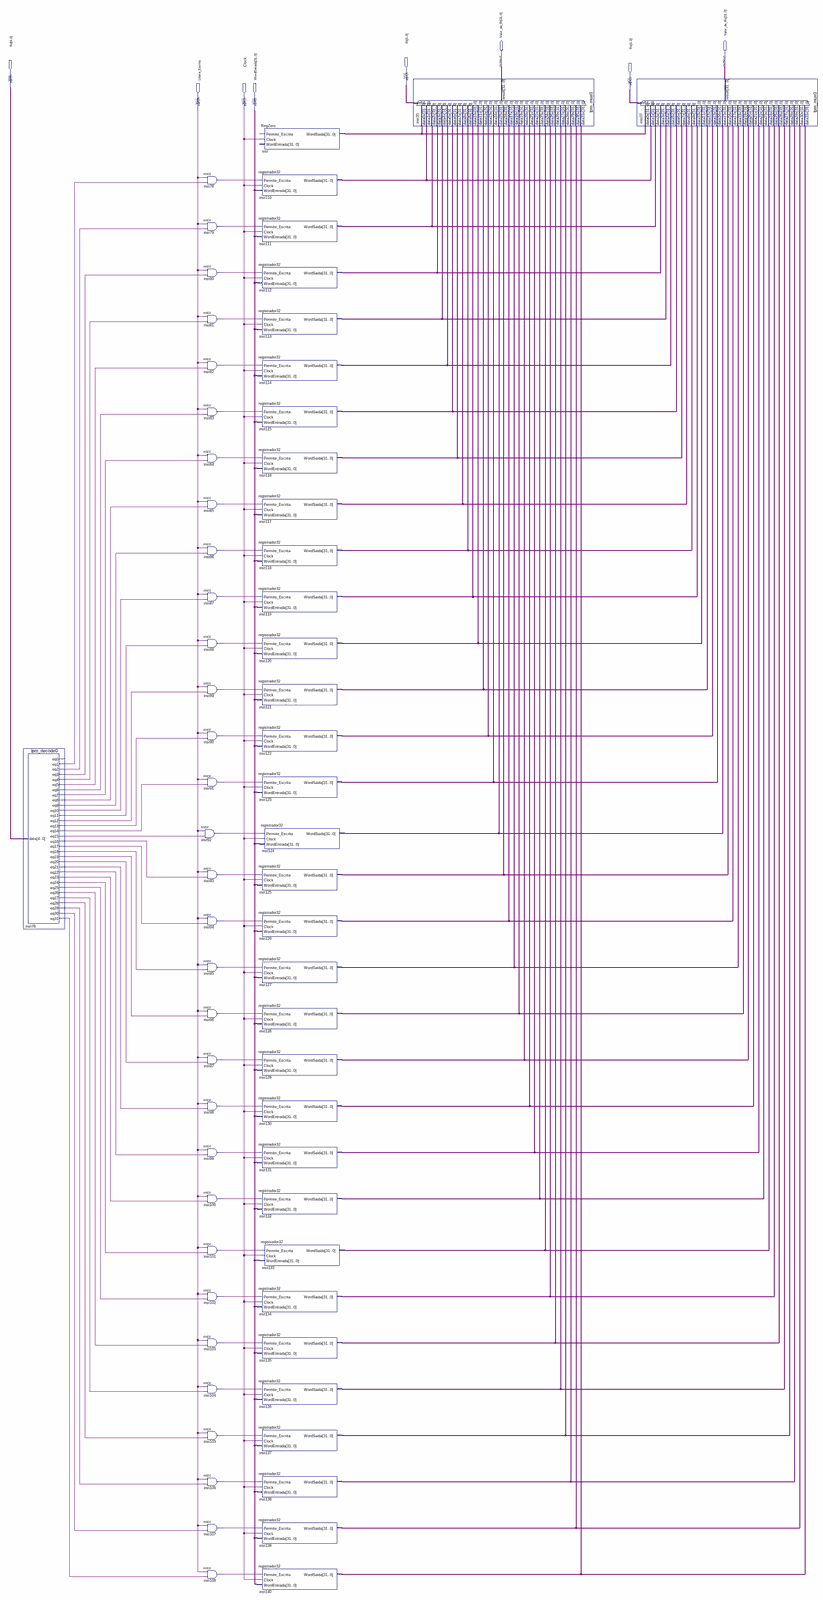
[diagram p0: schematic sheet, whole]
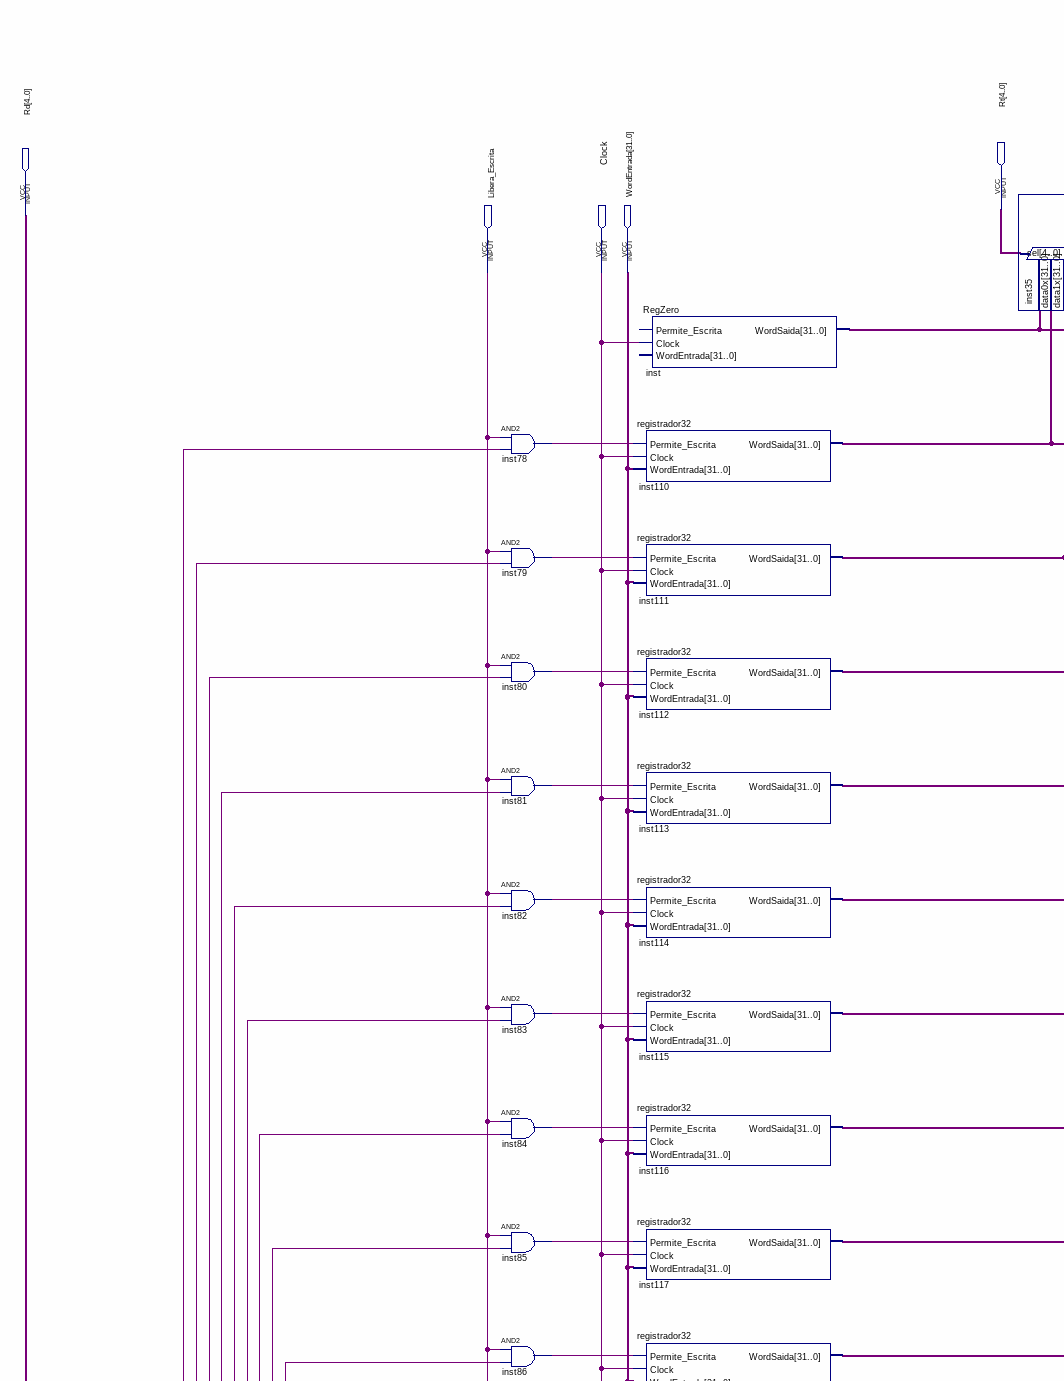
[diagram p1: schematic sheet, upper left part]
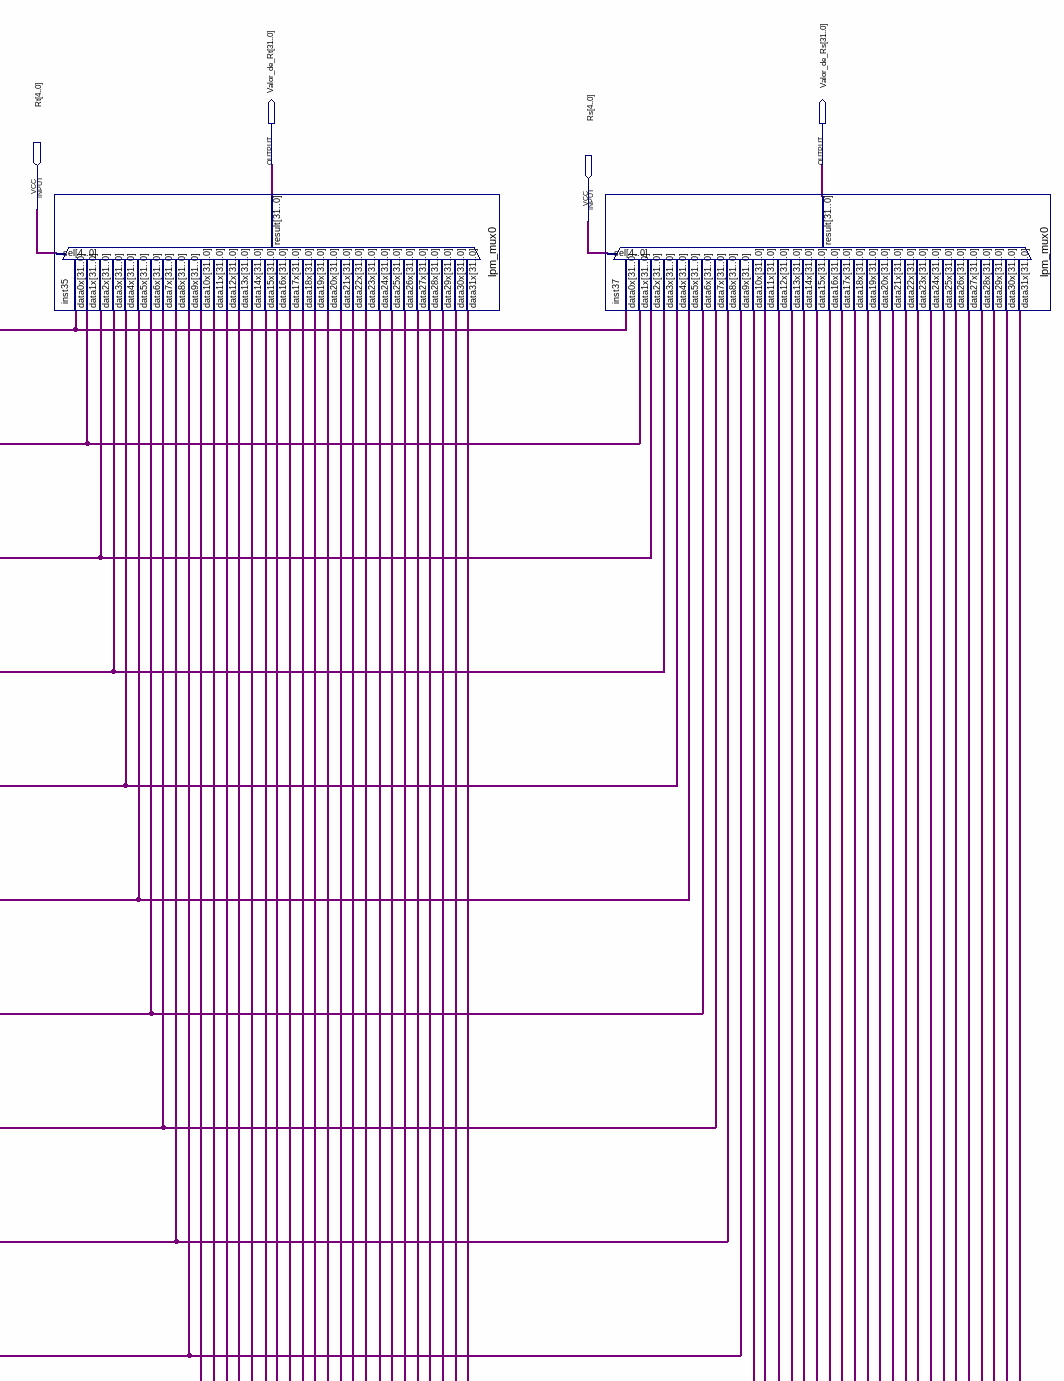
[diagram p2: schematic sheet, upper right part]
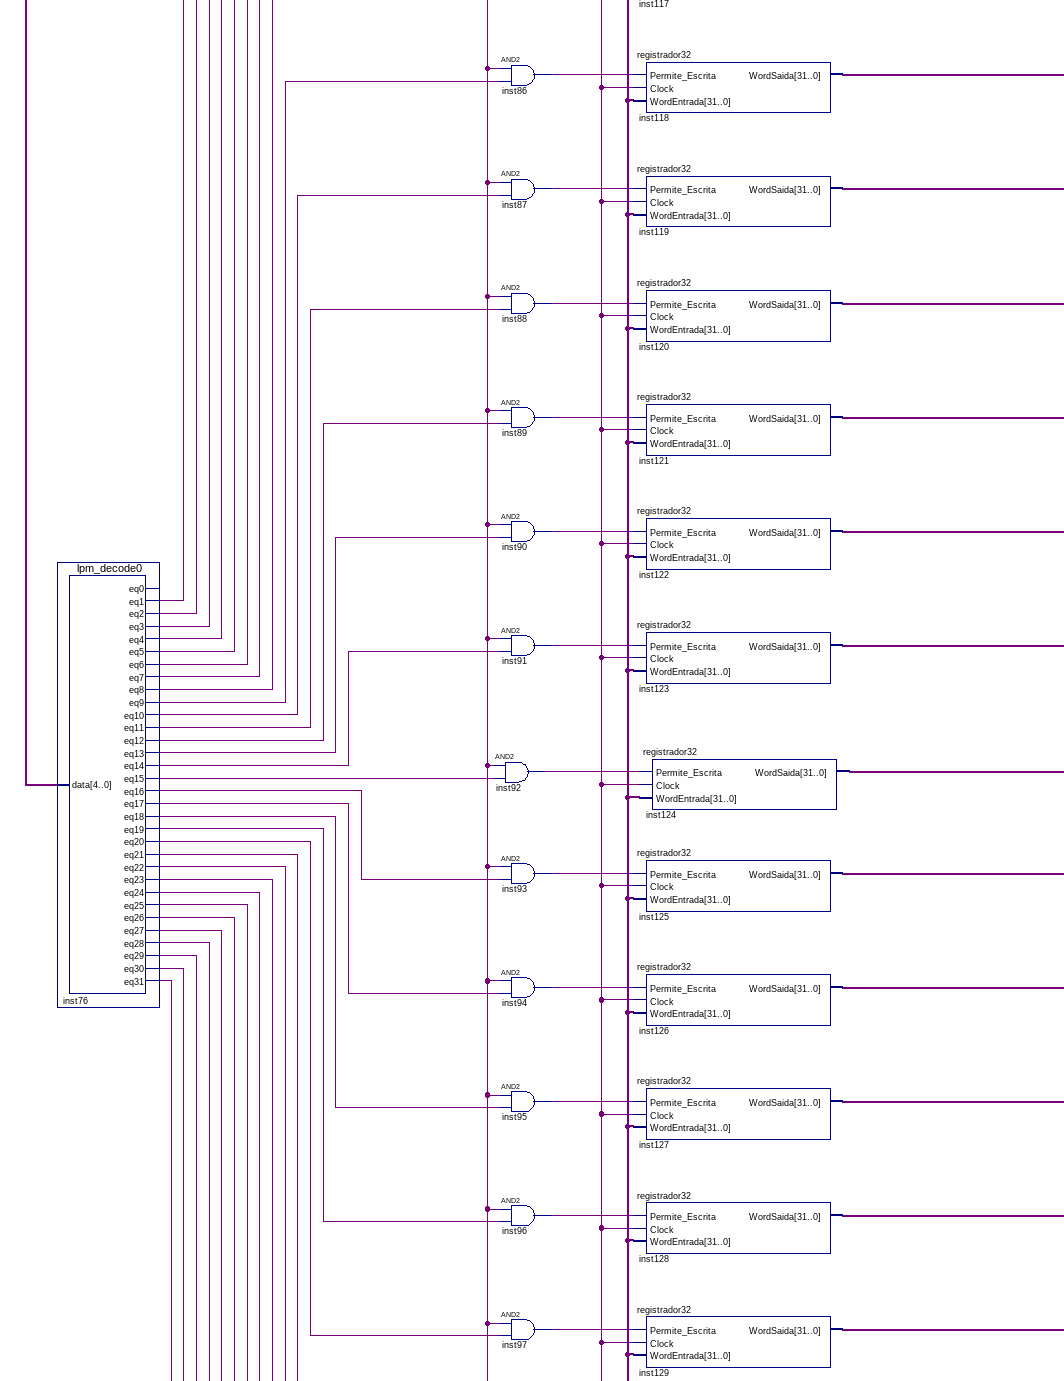
[diagram p3: schematic sheet, middle left part]
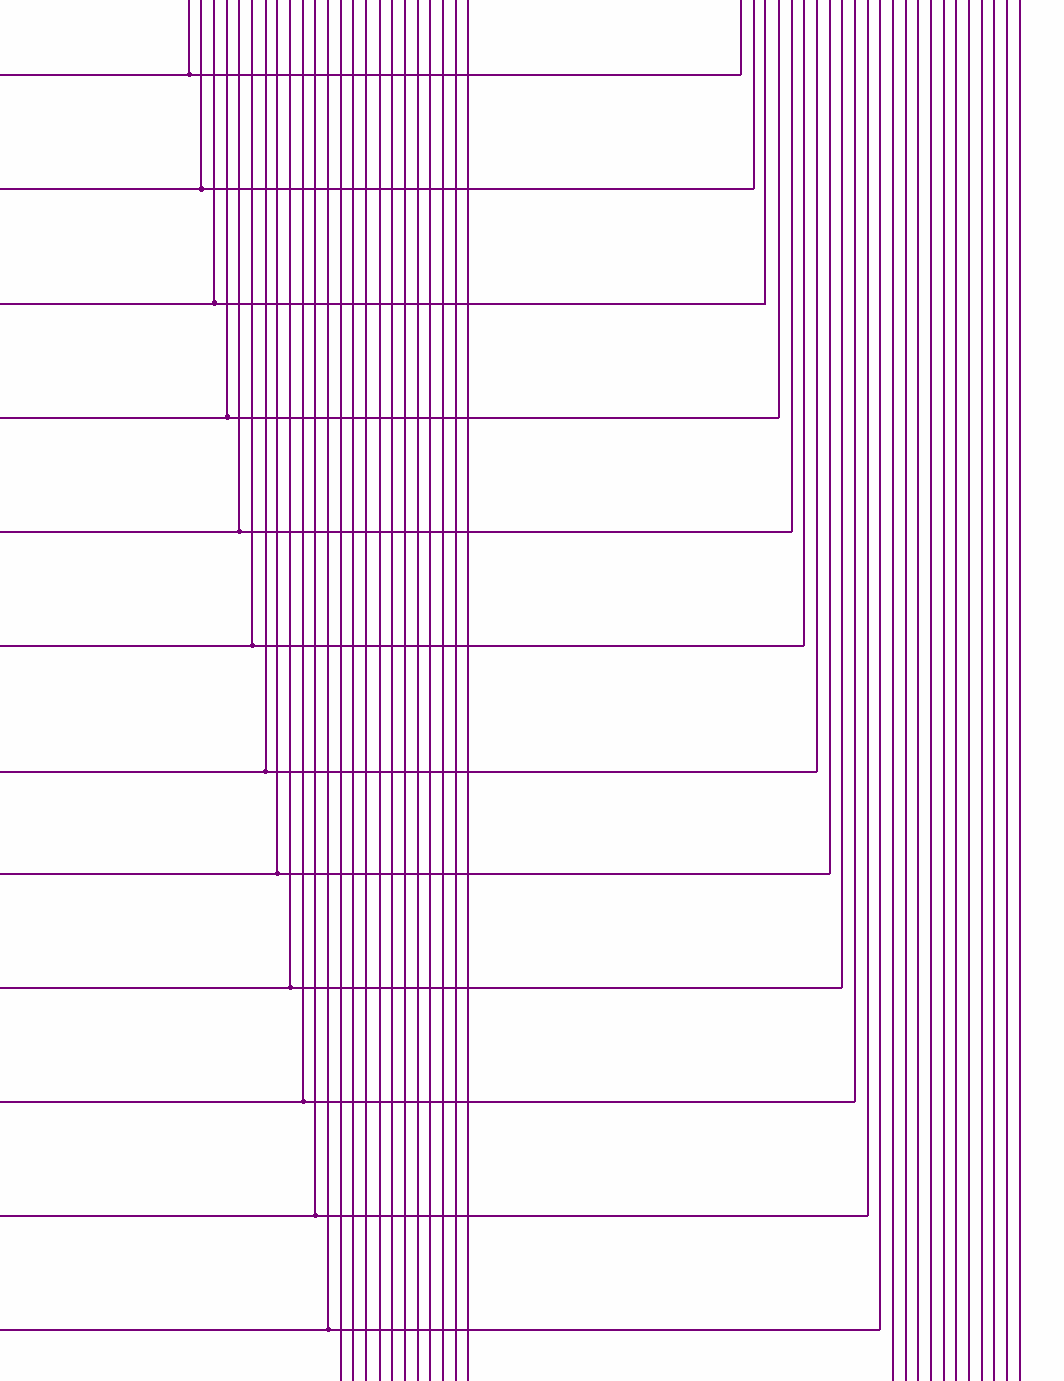
[diagram p4: schematic sheet, middle right part]
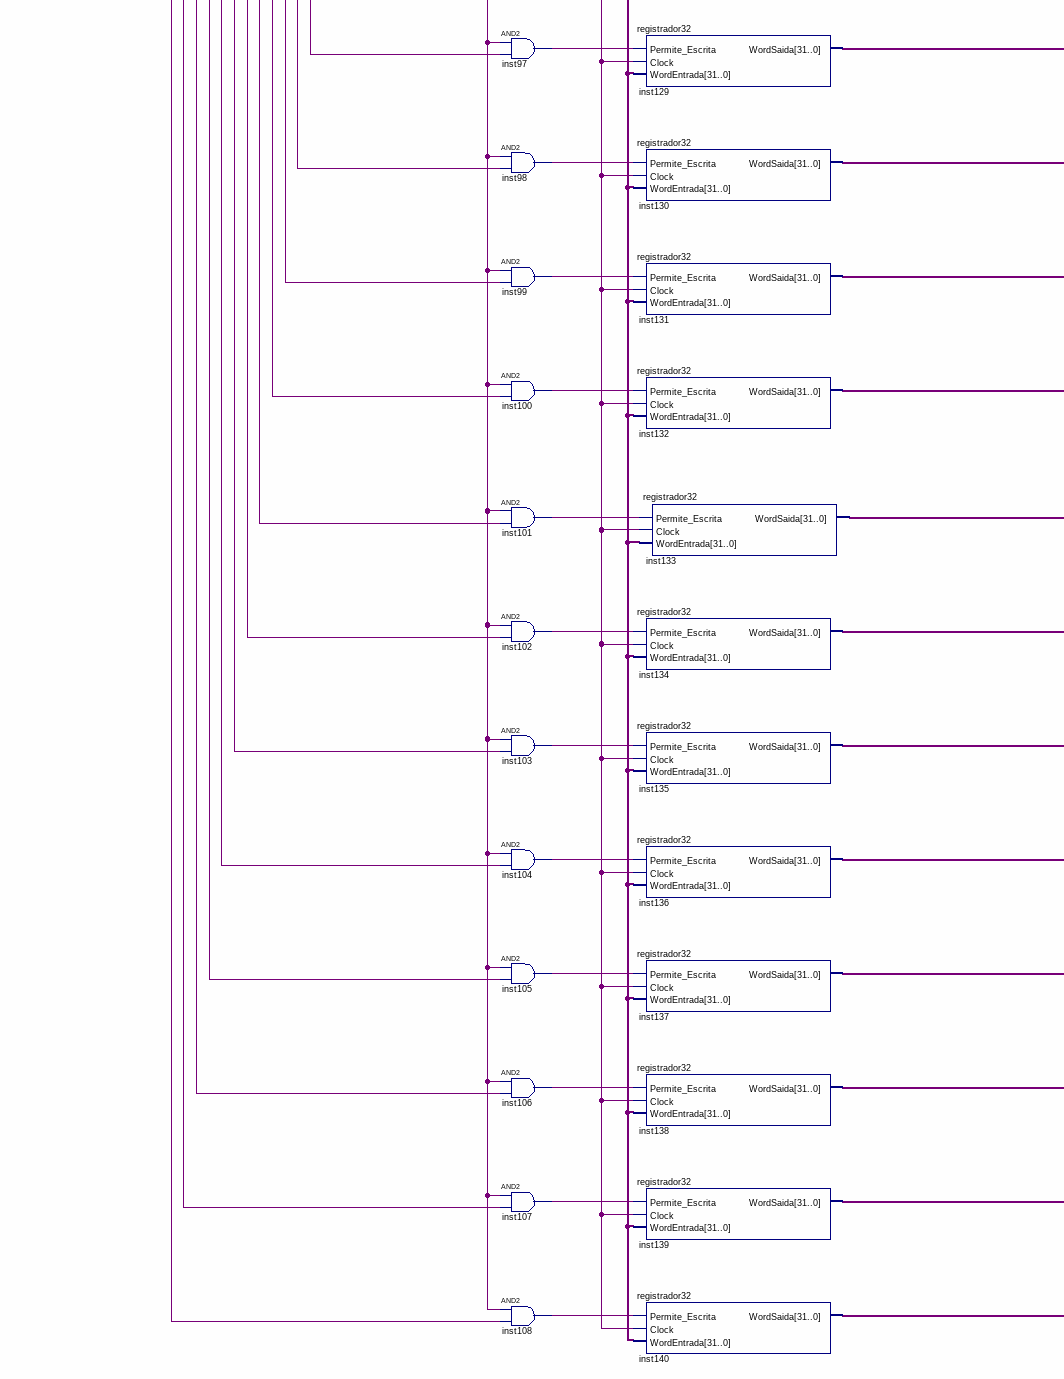
[diagram p5: schematic sheet, lower left part]
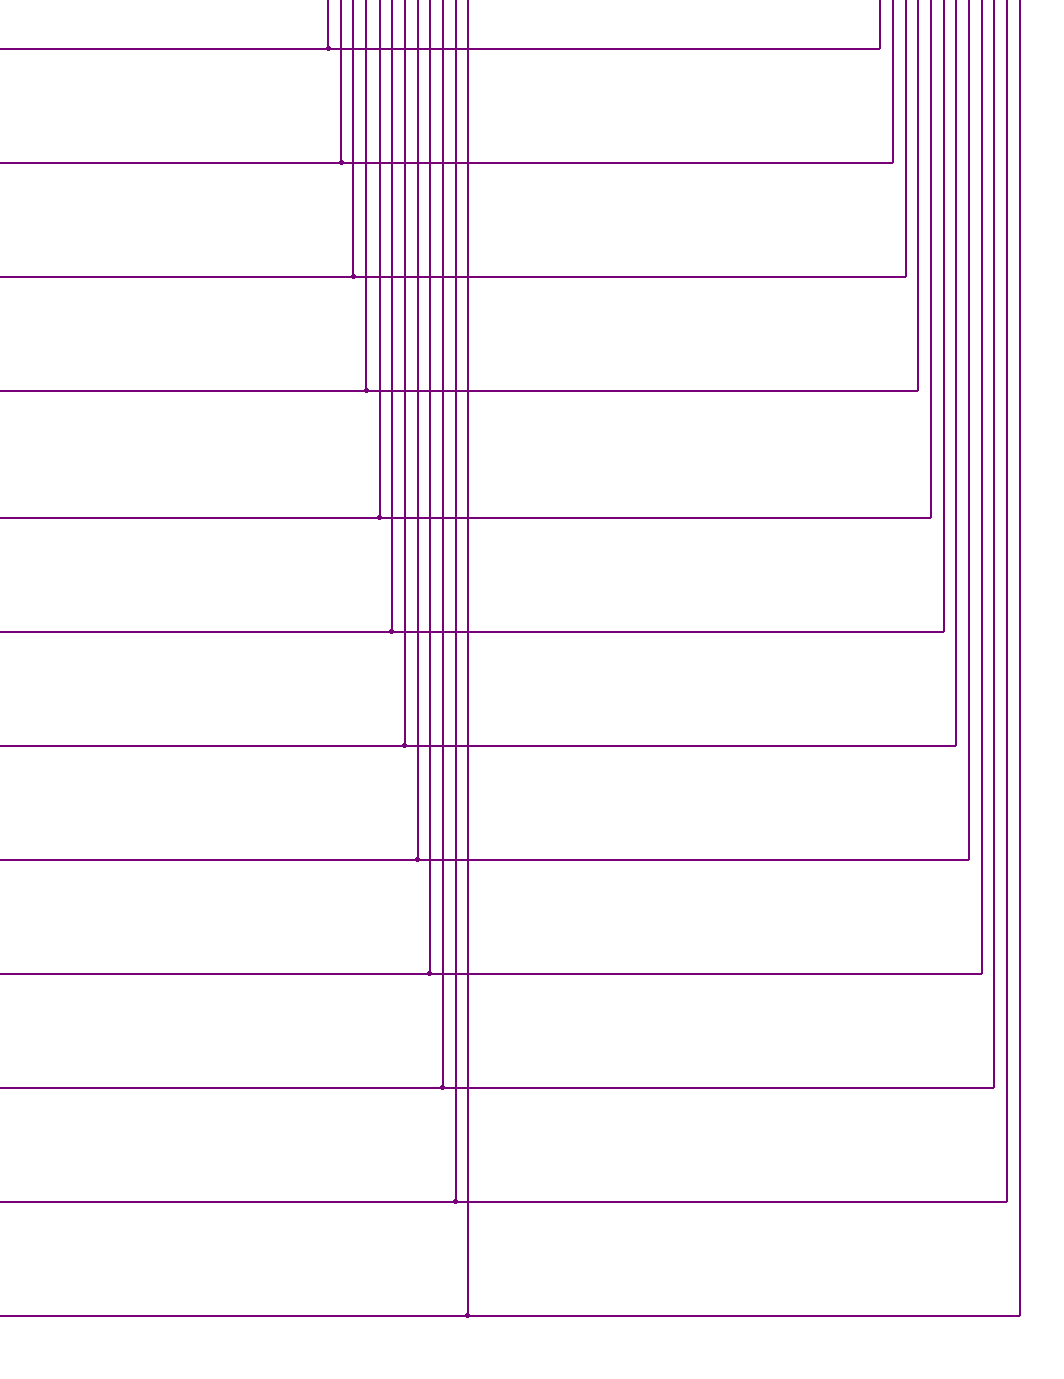
[diagram p6: schematic sheet, lower right part]
// Quartus schematic BancoReg.bdf as structural Verilog: 66 symbols, 8 pins
module BancoReg (
  input  [4:0] Rt,
  input  [4:0] Rd,
  input  [4:0] Rs,
  input  Libera_Escrita,
  input  Clock,
  input  [31:0] WordEntrada,
  output [31:0] Valor_de_Rt,
  output [31:0] Valor_de_Rs
);

  wire inst76_eq1, inst76_eq2, inst76_eq3, inst76_eq4, inst76_eq5, inst76_eq6, inst76_eq7, inst76_eq8,
       inst76_eq9, inst76_eq10, inst76_eq11, inst76_eq12, inst76_eq13, inst76_eq14, inst76_eq15, inst76_eq16,
       inst76_eq17, inst76_eq18, inst76_eq19, inst76_eq20, inst76_eq21, inst76_eq22, inst76_eq23,
       inst76_eq24, inst76_eq25, inst76_eq26, inst76_eq27, inst76_eq28, inst76_eq29, inst76_eq30,
       inst76_eq31, inst78_out, inst79_out, inst80_out, inst81_out, inst82_out, inst83_out, inst84_out,
       inst85_out, inst86_out, inst87_out, inst88_out, inst89_out, inst90_out, inst91_out, inst92_out,
       inst93_out, inst94_out, inst95_out, inst96_out, inst97_out, inst98_out, inst99_out, inst100_out,
       inst101_out, inst102_out, inst103_out, inst104_out, inst105_out, inst106_out, inst107_out, inst108_out;
  wire [31:0] inst110_wordsaida, inst111_wordsaida, inst112_wordsaida, inst113_wordsaida, inst114_wordsaida,
       inst115_wordsaida, inst116_wordsaida, inst117_wordsaida, inst118_wordsaida, inst119_wordsaida,
       inst120_wordsaida, inst121_wordsaida, inst122_wordsaida, inst123_wordsaida, inst124_wordsaida,
       inst125_wordsaida, inst126_wordsaida, inst127_wordsaida, inst128_wordsaida, inst129_wordsaida,
       inst130_wordsaida, inst131_wordsaida, inst132_wordsaida, inst133_wordsaida, inst134_wordsaida,
       inst135_wordsaida, inst136_wordsaida, inst137_wordsaida, inst138_wordsaida, inst139_wordsaida,
       inst140_wordsaida, inst_wordsaida;

  lpm_decode0 inst76 (
    .data(Rd), .eq1(inst76_eq1), .eq2(inst76_eq2), .eq3(inst76_eq3), .eq4(inst76_eq4), .eq5(inst76_eq5),
    .eq6(inst76_eq6), .eq7(inst76_eq7), .eq8(inst76_eq8), .eq9(inst76_eq9), .eq10(inst76_eq10),
    .eq11(inst76_eq11), .eq12(inst76_eq12), .eq13(inst76_eq13), .eq14(inst76_eq14), .eq15(inst76_eq15),
    .eq16(inst76_eq16), .eq17(inst76_eq17), .eq18(inst76_eq18), .eq19(inst76_eq19), .eq20(inst76_eq20),
    .eq21(inst76_eq21), .eq22(inst76_eq22), .eq23(inst76_eq23), .eq24(inst76_eq24), .eq25(inst76_eq25),
    .eq26(inst76_eq26), .eq27(inst76_eq27), .eq28(inst76_eq28), .eq29(inst76_eq29), .eq30(inst76_eq30),
    .eq31(inst76_eq31));  // open: eq0
  and inst78 (inst78_out, Libera_Escrita, inst76_eq1);
  and inst79 (inst79_out, Libera_Escrita, inst76_eq2);
  and inst80 (inst80_out, Libera_Escrita, inst76_eq3);
  and inst81 (inst81_out, Libera_Escrita, inst76_eq4);
  and inst82 (inst82_out, Libera_Escrita, inst76_eq5);
  and inst83 (inst83_out, Libera_Escrita, inst76_eq6);
  and inst84 (inst84_out, Libera_Escrita, inst76_eq7);
  and inst85 (inst85_out, Libera_Escrita, inst76_eq8);
  and inst86 (inst86_out, Libera_Escrita, inst76_eq9);
  and inst87 (inst87_out, Libera_Escrita, inst76_eq10);
  and inst88 (inst88_out, Libera_Escrita, inst76_eq11);
  and inst89 (inst89_out, Libera_Escrita, inst76_eq12);
  and inst90 (inst90_out, Libera_Escrita, inst76_eq13);
  and inst91 (inst91_out, Libera_Escrita, inst76_eq14);
  and inst92 (inst92_out, Libera_Escrita, inst76_eq15);
  and inst93 (inst93_out, Libera_Escrita, inst76_eq16);
  and inst94 (inst94_out, Libera_Escrita, inst76_eq17);
  and inst95 (inst95_out, Libera_Escrita, inst76_eq18);
  and inst96 (inst96_out, Libera_Escrita, inst76_eq19);
  and inst97 (inst97_out, Libera_Escrita, inst76_eq20);
  and inst98 (inst98_out, Libera_Escrita, inst76_eq21);
  and inst99 (inst99_out, Libera_Escrita, inst76_eq22);
  and inst100 (inst100_out, Libera_Escrita, inst76_eq23);
  and inst101 (inst101_out, Libera_Escrita, inst76_eq24);
  and inst102 (inst102_out, Libera_Escrita, inst76_eq25);
  and inst103 (inst103_out, Libera_Escrita, inst76_eq26);
  and inst104 (inst104_out, Libera_Escrita, inst76_eq27);
  and inst105 (inst105_out, Libera_Escrita, inst76_eq28);
  and inst106 (inst106_out, Libera_Escrita, inst76_eq29);
  and inst107 (inst107_out, Libera_Escrita, inst76_eq30);
  and inst108 (inst108_out, Libera_Escrita, inst76_eq31);
  RegZero inst (.Clock(Clock), .WordSaida(inst_wordsaida));  // open: Permite_Escrita, WordEntrada
  registrador32 inst110 (
    .Permite_Escrita(inst78_out), .Clock(Clock), .WordEntrada(WordEntrada), .WordSaida(inst110_wordsaida));
  registrador32 inst111 (
    .Permite_Escrita(inst79_out), .Clock(Clock), .WordEntrada(WordEntrada), .WordSaida(inst111_wordsaida));
  registrador32 inst112 (
    .Permite_Escrita(inst80_out), .Clock(Clock), .WordEntrada(WordEntrada), .WordSaida(inst112_wordsaida));
  registrador32 inst113 (
    .Permite_Escrita(inst81_out), .Clock(Clock), .WordEntrada(WordEntrada), .WordSaida(inst113_wordsaida));
  registrador32 inst114 (
    .Permite_Escrita(inst82_out), .Clock(Clock), .WordEntrada(WordEntrada), .WordSaida(inst114_wordsaida));
  registrador32 inst115 (
    .Permite_Escrita(inst83_out), .Clock(Clock), .WordEntrada(WordEntrada), .WordSaida(inst115_wordsaida));
  registrador32 inst116 (
    .Permite_Escrita(inst84_out), .Clock(Clock), .WordEntrada(WordEntrada), .WordSaida(inst116_wordsaida));
  registrador32 inst117 (
    .Permite_Escrita(inst85_out), .Clock(Clock), .WordEntrada(WordEntrada), .WordSaida(inst117_wordsaida));
  registrador32 inst118 (
    .Permite_Escrita(inst86_out), .Clock(Clock), .WordEntrada(WordEntrada), .WordSaida(inst118_wordsaida));
  registrador32 inst119 (
    .Permite_Escrita(inst87_out), .Clock(Clock), .WordEntrada(WordEntrada), .WordSaida(inst119_wordsaida));
  registrador32 inst120 (
    .Permite_Escrita(inst88_out), .Clock(Clock), .WordEntrada(WordEntrada), .WordSaida(inst120_wordsaida));
  registrador32 inst121 (
    .Permite_Escrita(inst89_out), .Clock(Clock), .WordEntrada(WordEntrada), .WordSaida(inst121_wordsaida));
  registrador32 inst122 (
    .Permite_Escrita(inst90_out), .Clock(Clock), .WordEntrada(WordEntrada), .WordSaida(inst122_wordsaida));
  registrador32 inst123 (
    .Permite_Escrita(inst91_out), .Clock(Clock), .WordEntrada(WordEntrada), .WordSaida(inst123_wordsaida));
  registrador32 inst124 (
    .Permite_Escrita(inst92_out), .Clock(Clock), .WordEntrada(WordEntrada), .WordSaida(inst124_wordsaida));
  registrador32 inst125 (
    .Permite_Escrita(inst93_out), .Clock(Clock), .WordEntrada(WordEntrada), .WordSaida(inst125_wordsaida));
  registrador32 inst126 (
    .Permite_Escrita(inst94_out), .Clock(Clock), .WordEntrada(WordEntrada), .WordSaida(inst126_wordsaida));
  registrador32 inst127 (
    .Permite_Escrita(inst95_out), .Clock(Clock), .WordEntrada(WordEntrada), .WordSaida(inst127_wordsaida));
  registrador32 inst128 (
    .Permite_Escrita(inst96_out), .Clock(Clock), .WordEntrada(WordEntrada), .WordSaida(inst128_wordsaida));
  registrador32 inst129 (
    .Permite_Escrita(inst97_out), .Clock(Clock), .WordEntrada(WordEntrada), .WordSaida(inst129_wordsaida));
  registrador32 inst130 (
    .Permite_Escrita(inst98_out), .Clock(Clock), .WordEntrada(WordEntrada), .WordSaida(inst130_wordsaida));
  registrador32 inst131 (
    .Permite_Escrita(inst99_out), .Clock(Clock), .WordEntrada(WordEntrada), .WordSaida(inst131_wordsaida));
  registrador32 inst132 (
    .Permite_Escrita(inst100_out), .Clock(Clock), .WordEntrada(WordEntrada), .WordSaida(inst132_wordsaida));
  registrador32 inst133 (
    .Permite_Escrita(inst101_out), .Clock(Clock), .WordEntrada(WordEntrada), .WordSaida(inst133_wordsaida));
  registrador32 inst134 (
    .Permite_Escrita(inst102_out), .Clock(Clock), .WordEntrada(WordEntrada), .WordSaida(inst134_wordsaida));
  registrador32 inst135 (
    .Permite_Escrita(inst103_out), .Clock(Clock), .WordEntrada(WordEntrada), .WordSaida(inst135_wordsaida));
  registrador32 inst136 (
    .Permite_Escrita(inst104_out), .Clock(Clock), .WordEntrada(WordEntrada), .WordSaida(inst136_wordsaida));
  registrador32 inst137 (
    .Permite_Escrita(inst105_out), .Clock(Clock), .WordEntrada(WordEntrada), .WordSaida(inst137_wordsaida));
  registrador32 inst138 (
    .Permite_Escrita(inst106_out), .Clock(Clock), .WordEntrada(WordEntrada), .WordSaida(inst138_wordsaida));
  registrador32 inst139 (
    .Permite_Escrita(inst107_out), .Clock(Clock), .WordEntrada(WordEntrada), .WordSaida(inst139_wordsaida));
  registrador32 inst140 (
    .Permite_Escrita(inst108_out), .Clock(Clock), .WordEntrada(WordEntrada), .WordSaida(inst140_wordsaida));
  lpm_mux0 inst35 (
    .data31x(inst140_wordsaida), .data30x(inst139_wordsaida), .data29x(inst138_wordsaida),
    .data28x(inst137_wordsaida), .data27x(inst136_wordsaida), .data26x(inst135_wordsaida),
    .data25x(inst134_wordsaida), .data24x(inst133_wordsaida), .data23x(inst132_wordsaida),
    .data22x(inst131_wordsaida), .data21x(inst130_wordsaida), .data20x(inst129_wordsaida),
    .data19x(inst128_wordsaida), .data18x(inst127_wordsaida), .data17x(inst126_wordsaida),
    .data16x(inst125_wordsaida), .data15x(inst124_wordsaida), .data14x(inst123_wordsaida),
    .data13x(inst122_wordsaida), .data12x(inst121_wordsaida), .data11x(inst120_wordsaida),
    .data10x(inst119_wordsaida), .data9x(inst118_wordsaida), .data8x(inst117_wordsaida),
    .data7x(inst116_wordsaida), .data6x(inst115_wordsaida), .data5x(inst114_wordsaida),
    .data4x(inst113_wordsaida), .data3x(inst112_wordsaida), .data2x(inst111_wordsaida),
    .data1x(inst110_wordsaida), .data0x(inst_wordsaida), .sel(Rt), .result(Valor_de_Rt));
  lpm_mux0 inst37 (
    .data31x(inst140_wordsaida), .data30x(inst139_wordsaida), .data29x(inst138_wordsaida),
    .data28x(inst137_wordsaida), .data27x(inst136_wordsaida), .data26x(inst135_wordsaida),
    .data25x(inst134_wordsaida), .data24x(inst133_wordsaida), .data23x(inst132_wordsaida),
    .data22x(inst131_wordsaida), .data21x(inst130_wordsaida), .data20x(inst129_wordsaida),
    .data19x(inst128_wordsaida), .data18x(inst127_wordsaida), .data17x(inst126_wordsaida),
    .data16x(inst125_wordsaida), .data15x(inst124_wordsaida), .data14x(inst123_wordsaida),
    .data13x(inst122_wordsaida), .data12x(inst121_wordsaida), .data11x(inst120_wordsaida),
    .data10x(inst119_wordsaida), .data9x(inst118_wordsaida), .data8x(inst117_wordsaida),
    .data7x(inst116_wordsaida), .data6x(inst115_wordsaida), .data5x(inst114_wordsaida),
    .data4x(inst113_wordsaida), .data3x(inst112_wordsaida), .data2x(inst111_wordsaida),
    .data1x(inst110_wordsaida), .data0x(inst_wordsaida), .sel(Rs), .result(Valor_de_Rs));

  // Other names for the same wires on the sheet: data[4:0] = Rd
endmodule
